# EasyEDA Pro project firefly_rp2040.eprj, schematic Schematic1

## Sheets
1 P1: Board Name: display; Create Date: 2026-06-17; Page Name: P1; Project Name: firefly_rp2040; Schematic Name: Schematic1; Update Date: 2026-09-27; Company: EasyEDA.com; Page Size: A4; Version: V1.0
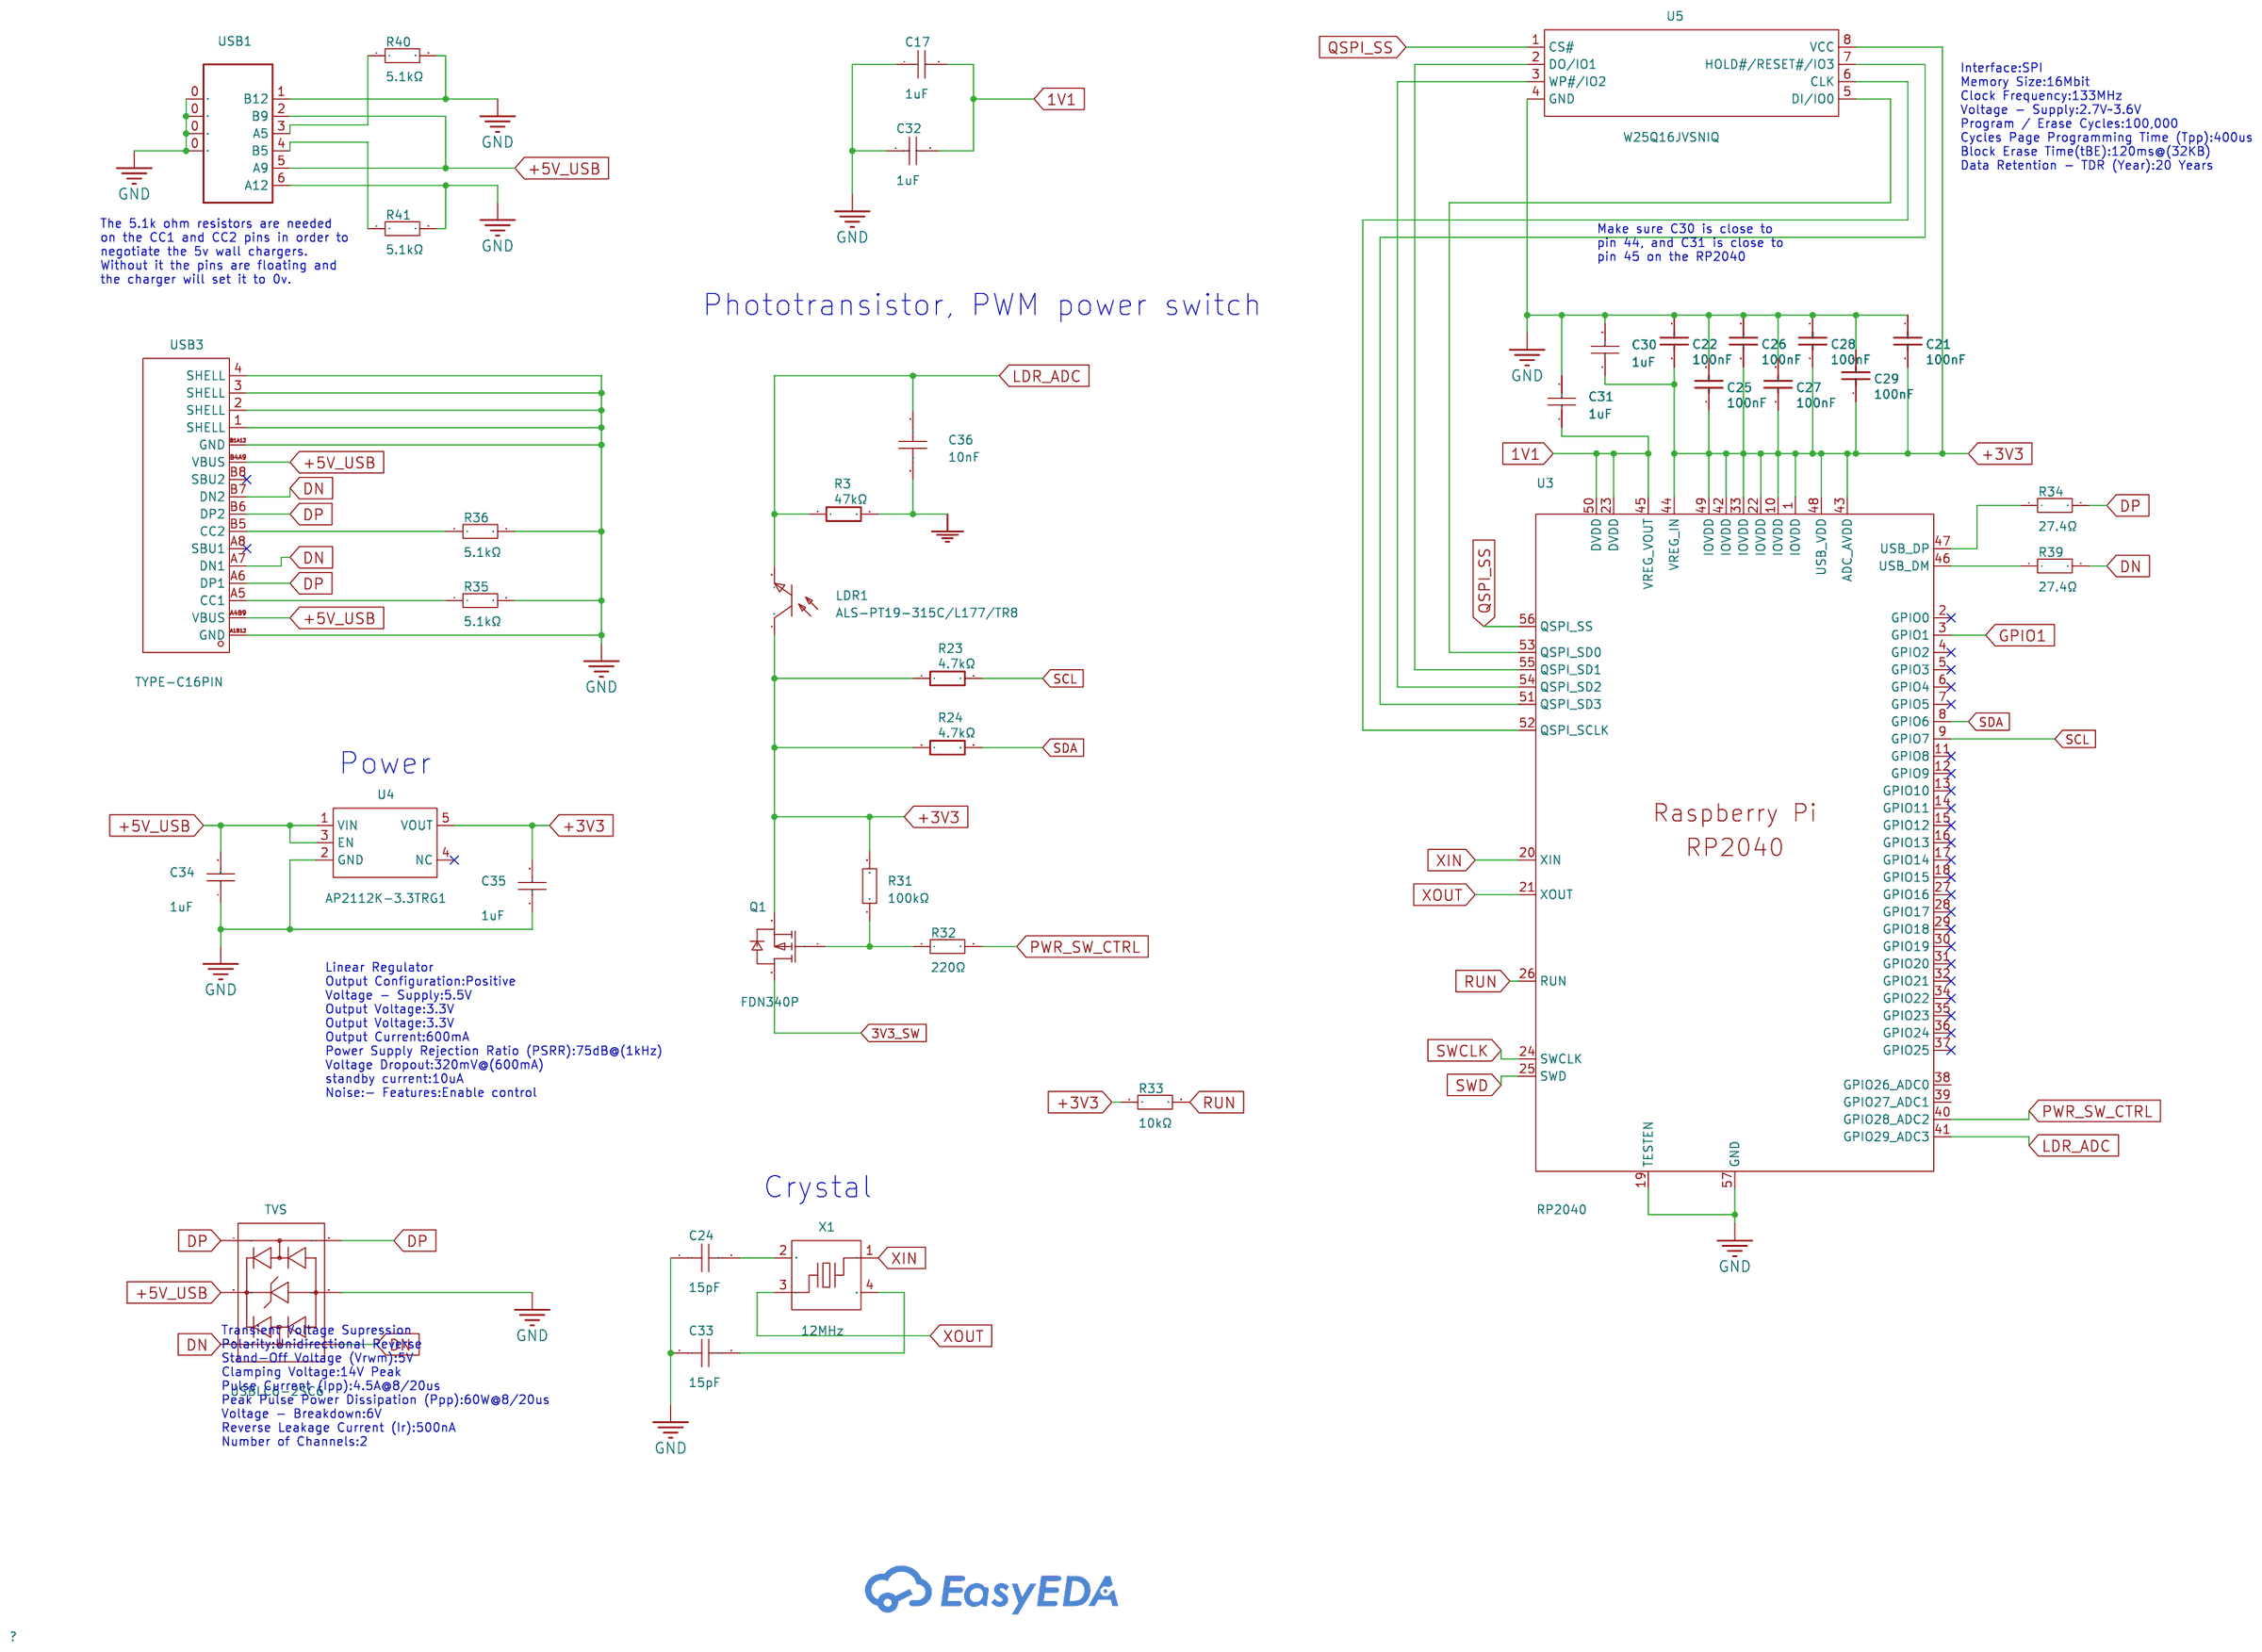
[diagram p0: P1]
2 P2: Board Name: Board1; Page Name: P2; Update Date: 2026-06-16
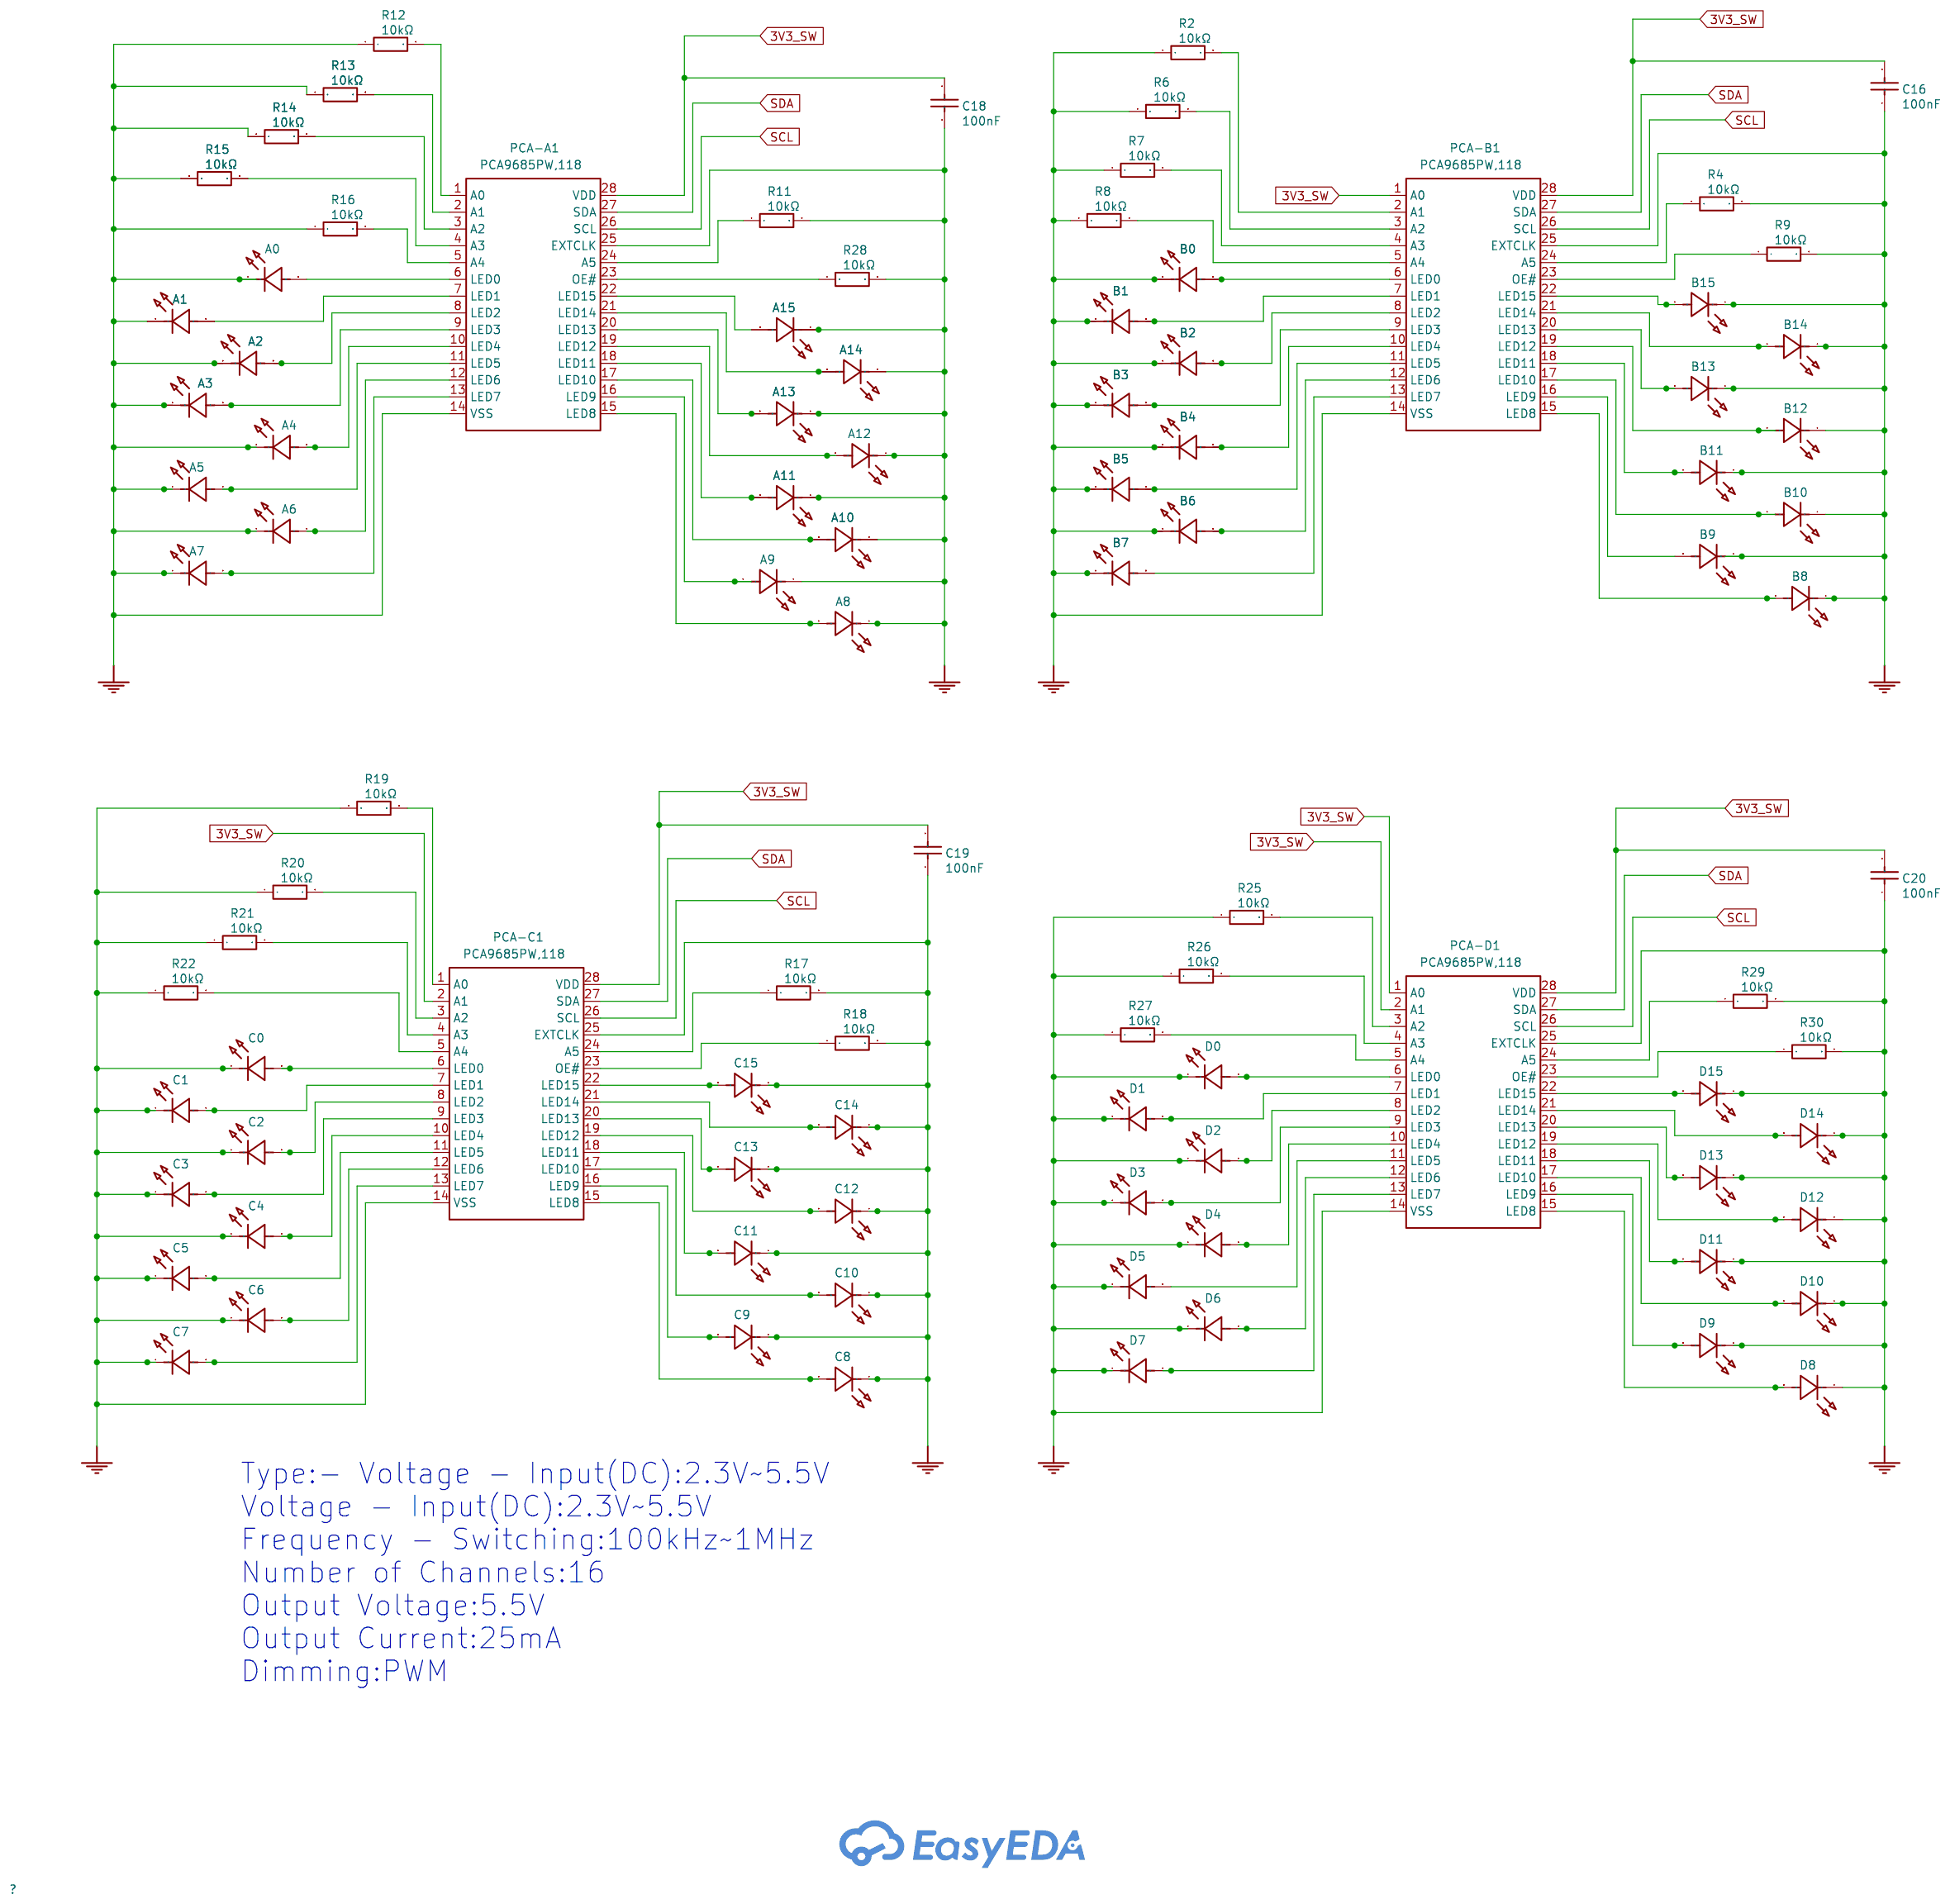
[diagram p1: P2]

## Parts
sheet P1
C17  1uF  [C0603]
C21  100nF  [C0603]
C22  100nF  [C0603]
C24  15pF  [C0603]
C25  100nF  [C0603]
C26  100nF  [C0603]
C27  100nF  [C0603]
C28  100nF  [C0603]
C29  100nF  [C0603]
C30  1uF  [C0603]
C31  1uF  [C0603]
C32  1uF  [C0603]
C33  15pF  [C0603]
C34  1uF  [C0603]
C35  1uF  [C0603]
C36  10nF  [C0603]
LDR1  ALS-PT19-315C/L177/TR8  [SENSORS-SMD_ALS-PT19]
Q1  FDN340P  [SOT-23-3_L3.0-W1.7-P0.95-LS2.9-BR]
R3  47kΩ  [R0603]
R23  4.7kΩ  [R0603]
R24  4.7kΩ  [R0603]
R31  100kΩ  [R0603]
R32  220Ω  [R0603]
R33  10kΩ  [R0603]
R34  27.4Ω  [R0603]
R35  5.1kΩ  [R0603]
R36  5.1kΩ  [R0603]
R39  27.4Ω  [R0603]
R40  5.1kΩ  [R0603]
R41  5.1kΩ  [R0603]
TVS  USBLC6-2SC6  [SOT-23-6_L2.9-W1.6-P0.95-LS2.8-BL]
U3  RP2040  [LQFN-56_L7.0-W7.0-P0.4-EP]
U4  AP2112K-3.3TRG1  [SOT-23-5_L2.9-W1.6-P0.95-LS2.8-BR]
U5  W25Q16JVSNIQ  [SOP-8_L4.9-W3.9-P1.27-LS6.0-BL]
USB1  USB-312-B-SU  [USB-C-SMD_10P-P1.00-L6.8-W8.9]
USB3  TYPE-C16PIN  [USB-C-SMD_TYPE-C16PIN]
X1  12MHz  [CRYSTAL-SMD_4P-L3.2-W2.5-BL]
sheet P2
A0  XL-2012WWC  [LED0805-RD_WHITE]
A1  XL-2012WWC  [LED0805-RD_WHITE]
A2  XL-2012WWC  [LED0805-RD_WHITE]
A3  XL-2012WWC  [LED0805-RD_WHITE]
A4  XL-2012WWC  [LED0805-RD_WHITE]
A5  XL-2012WWC  [LED0805-RD_WHITE]
A6  XL-2012WWC  [LED0805-RD_WHITE]
A7  XL-2012WWC  [LED0805-RD_WHITE]
A8  XL-2012WWC  [LED0805-RD_WHITE]
A9  XL-2012WWC  [LED0805-RD_WHITE]
A10  XL-2012WWC  [LED0805-RD_WHITE]
A11  XL-2012WWC  [LED0805-RD_WHITE]
A12  XL-2012WWC  [LED0805-RD_WHITE]
A13  XL-2012WWC  [LED0805-RD_WHITE]
A14  XL-2012WWC  [LED0805-RD_WHITE]
A15  XL-2012WWC  [LED0805-RD_WHITE]
B0  XL-2012WWC  [LED0805-RD_WHITE]
B1  XL-2012WWC  [LED0805-RD_WHITE]
B2  XL-2012WWC  [LED0805-RD_WHITE]
B3  XL-2012WWC  [LED0805-RD_WHITE]
B4  XL-2012WWC  [LED0805-RD_WHITE]
B5  XL-2012WWC  [LED0805-RD_WHITE]
B6  XL-2012WWC  [LED0805-RD_WHITE]
B7  XL-2012WWC  [LED0805-RD_WHITE]
B8  XL-2012WWC  [LED0805-RD_WHITE]
B9  XL-2012WWC  [LED0805-RD_WHITE]
B10  XL-2012WWC  [LED0805-RD_WHITE]
B11  XL-2012WWC  [LED0805-RD_WHITE]
B12  XL-2012WWC  [LED0805-RD_WHITE]
B13  XL-2012WWC  [LED0805-RD_WHITE]
B14  XL-2012WWC  [LED0805-RD_WHITE]
B15  XL-2012WWC  [LED0805-RD_WHITE]
C0  XL-2012WWC  [LED0805-RD_WHITE]
C1  XL-2012WWC  [LED0805-RD_WHITE]
C2  XL-2012WWC  [LED0805-RD_WHITE]
C3  XL-2012WWC  [LED0805-RD_WHITE]
C4  XL-2012WWC  [LED0805-RD_WHITE]
C5  XL-2012WWC  [LED0805-RD_WHITE]
C6  XL-2012WWC  [LED0805-RD_WHITE]
C7  XL-2012WWC  [LED0805-RD_WHITE]
C8  XL-2012WWC  [LED0805-RD_WHITE]
C9  XL-2012WWC  [LED0805-RD_WHITE]
C10  XL-2012WWC  [LED0805-RD_WHITE]
C11  XL-2012WWC  [LED0805-RD_WHITE]
C12  XL-2012WWC  [LED0805-RD_WHITE]
C13  XL-2012WWC  [LED0805-RD_WHITE]
C14  XL-2012WWC  [LED0805-RD_WHITE]
C15  XL-2012WWC  [LED0805-RD_WHITE]
C16  100nF  [C0603]
C18  100nF  [C0603]
C19  100nF  [C0603]
C20  100nF  [C0603]
D0  XL-2012WWC  [LED0805-RD_WHITE]
D1  XL-2012WWC  [LED0805-RD_WHITE]
D2  XL-2012WWC  [LED0805-RD_WHITE]
D3  XL-2012WWC  [LED0805-RD_WHITE]
D4  XL-2012WWC  [LED0805-RD_WHITE]
D5  XL-2012WWC  [LED0805-RD_WHITE]
D6  XL-2012WWC  [LED0805-RD_WHITE]
D7  XL-2012WWC  [LED0805-RD_WHITE]
D8  XL-2012WWC  [LED0805-RD_WHITE]
D9  XL-2012WWC  [LED0805-RD_WHITE]
D10  XL-2012WWC  [LED0805-RD_WHITE]
D11  XL-2012WWC  [LED0805-RD_WHITE]
D12  XL-2012WWC  [LED0805-RD_WHITE]
D13  XL-2012WWC  [LED0805-RD_WHITE]
D14  XL-2012WWC  [LED0805-RD_WHITE]
D15  XL-2012WWC  [LED0805-RD_WHITE]
PCA-A1  PCA9685PW,118  [TSSOP-28_L9.7-W4.4-P0.65-LS6.4-TL]
PCA-B1  PCA9685PW,118  [TSSOP-28_L9.7-W4.4-P0.65-LS6.4-TL]
PCA-C1  PCA9685PW,118  [TSSOP-28_L9.7-W4.4-P0.65-LS6.4-TL]
PCA-D1  PCA9685PW,118  [TSSOP-28_L9.7-W4.4-P0.65-LS6.4-TL]
R2  10kΩ  [R0603]
R4  10kΩ  [R0603]
R6  10kΩ  [R0603]
R7  10kΩ  [R0603]
R8  10kΩ  [R0603]
R9  10kΩ  [R0603]
R11  10kΩ  [R0603]
R12  10kΩ  [R0603]
R13  10kΩ  [R0603]
R14  10kΩ  [R0603]
R15  10kΩ  [R0603]
R16  10kΩ  [R0603]
R17  10kΩ  [R0603]
R18  10kΩ  [R0603]
R19  10kΩ  [R0603]
R20  10kΩ  [R0603]
R21  10kΩ  [R0603]
R22  10kΩ  [R0603]
R25  10kΩ  [R0603]
R26  10kΩ  [R0603]
R27  10kΩ  [R0603]
R28  10kΩ  [R0603]
R29  10kΩ  [R0603]
R30  10kΩ  [R0603]

## Library data of the parts
C17 C30-C32 C34 C35 = CL10A105KO8NNNC: Capacitance:1uF Tolerance:±10% Tolerance:±10% Voltage Rating:16V Temperature Coefficient:X5R; LCSC Part Name: 1uF ±10% 16V; Supplier Part: C1592; Manufacturer: SAMSUNG(三星); Supplier Footprint: 0603; JLCPCB Part Class: Extended Part; Datasheet: https://item.szlcsc.com/datasheet/CL10A105KO8NNNC/1944.html; Supplier: LCSC; Tolerance: ±10%; Voltage Rating: 16V; Temperature Coefficient: X5R
C16 C18-C22 C25-C29 = TCC0603X7R104J500CT: Capacitance:100nF Tolerance:±5% Tolerance:±5% Voltage Rating:50V Temperature Coefficient:X7R; LCSC Part Name: 100nF ±5% 50V; Supplier Part: C282518; Manufacturer: CCTC(三环); Supplier Footprint: 0603; JLCPCB Part Class: Extended Part; Datasheet: https://item.szlcsc.com/datasheet/TCC0603X7R104J500CT/268638.html; Supplier: LCSC; Tolerance: ±5%; Voltage Rating: 50V; Temperature Coefficient: X7R
C24 C33 = CC0603JRNPO9BN150: Capacitance:15pF Tolerance:±5% Tolerance:±5% Voltage Rating:50V Temperature Coefficient:NP0; LCSC Part Name: 15pF ±5% 50V; Supplier Part: C107037; Manufacturer: YAGEO(国巨); Supplier Footprint: 0603; JLCPCB Part Class: Extended Part; Datasheet: https://item.szlcsc.com/datasheet/CC0603JRNPO9BN150/108253.html; Supplier: LCSC; Tolerance: ±5%; Voltage Rating: 50V; Temperature Coefficient: NP0
C36 = FN18X103K500PSG: Capacitance:10nF Tolerance:±10% Tolerance:±10% Voltage Rating:50V Temperature Coefficient:X7R; LCSC Part Name: 10nF ±10% 50V; Supplier Part: C525264; Manufacturer: PSA(信昌电陶); Supplier Footprint: 0603; JLCPCB Part Class: Extended Part; Datasheet: https://item.szlcsc.com/datasheet/FN18X103K500PSG/543391.html; Supplier: LCSC; Tolerance: ±10%; Voltage Rating: 50V; Temperature Coefficient: X7R
LDR1 = ALS-PT19-315C/L177/TR8: Measurement Type:Light Intensity Voltage - Supply:2.5V~5.5V Voltage - Supply:2.5V~5.5V Operating Temperature:-40℃~+85℃ Operating Temperature:-40℃~+85℃ Length:1.7mm Width:0.8mm Height:0.6mm Features:Spectral correction/filtering; LCSC Part Name: 环境光传感器; Supplier Part: C146233; Manufacturer: EVERLIGHT(亿光); Supplier Footprint: 0603; JLCPCB Part Class: Extended Part; Datasheet: https://en.everlight.com/wp-content/plugins/ItemRelationship/product_files/pdf/ALS-PT19-315C-L177-TR8_V8.pdf; Supplier: LCSC; Measurement Type: Light Intensity; Voltage - Supply: 2.5V~5.5V; Operating Temperature: -40℃~+85℃; Length: 1.7mm; Width: 0.8mm; Height: 0.6mm; Features: Spectral correction/filtering
Q1 = FDN340P_C22365185: LCSC Part Name: P沟道贴片式MOSFET; Supplier Part: C22365185; Manufacturer: FUXINSEMI(富芯森美); Supplier Footprint: SOT-23; JLCPCB Part Class: Extended Part; Datasheet: https://item.szlcsc.com/datasheet/FDN340P/23829803.html; Supplier: LCSC; Drain to Source Voltage: 20V; Current - Continuous Drain(Id): 3A; RDS(on): 142mΩ@2.5V; Pd - Power Dissipation: 400mW; Gate Threshold Voltage (Vgs(th)): 1V@250uA; Gate Charge(Qg): 6.6nC@4.5V; Input Capacitance(Ciss): 500pF; Reverse Transfer Capacitance (Crss@Vds): 80pF; Operating Temperature: -55℃~+150℃; Output Capacitance(Coss): 120pF
R3 = 0603WAJ0473T5E: Type:Thick Film Resistor Resistance:47kΩ Tolerance:±5% Tolerance:±5% Power(Watts):100mW Voltage-Supply(Max):75V Temperature Coefficient:±100ppm/℃ Temperature Coefficient:±100ppm/℃ Operating Temperature:-55℃~+155℃ Operating Temperature:-55℃~+155℃; LCSC Part Name: 厚膜电阻 47kΩ ±5%; Supplier Part: C25600; Manufacturer: UNI-ROYAL(厚声); Supplier Footprint: 0603; JLCPCB Part Class: Extended Part; Datasheet: https://item.szlcsc.com/datasheet/0603WAJ0473T5E/26343.html; Supplier: LCSC; Type: Thick Film Resistor; Tolerance: ±5%; Power(Watts): 100mW; Voltage-Supply(Max): 75V; Temperature Coefficient: ±100ppm/℃; Operating Temperature: -55℃~+155℃
R23 R24 = FRC0603F4701TS: Type:Thick Film Resistor Resistance:4.7kΩ Tolerance:±1% Tolerance:±1% Power(Watts):100mW Voltage-Supply(Max):75V Temperature Coefficient:±100ppm/℃ Temperature Coefficient:±100ppm/℃ Operating Temperature:-55℃~+155℃ Operating Temperature:-55℃~+155℃; LCSC Part Name: 4.7kΩ ±1% 100mW 厚膜电阻; Supplier Part: C2907034; Manufacturer: FOJAN(富捷); Supplier Footprint: 0603; JLCPCB Part Class: Extended Part; Supplier: LCSC; Type: Thick Film Resistor; Tolerance: ±1%; Power(Watts): 100mW; Voltage-Supply(Max): 75V; Temperature Coefficient: ±100ppm/℃; Operating Temperature: -55℃~+155℃
R31 = FRC0603J104 TS: Type:Thick Film Resistor Resistance:100kΩ Tolerance:±5% Tolerance:±5% Power(Watts):100mW Voltage-Supply(Max):75V Temperature Coefficient:±100ppm/℃ Temperature Coefficient:±100ppm/℃ Operating Temperature:-55℃~+155℃ Operating Temperature:-55℃~+155℃; LCSC Part Name: 100kΩ ±5% 100mW 厚膜电阻; Supplier Part: C2907088; Manufacturer: FOJAN(富捷); Supplier Footprint: 0603; JLCPCB Part Class: Extended Part; Supplier: LCSC; Type: Thick Film Resistor; Tolerance: ±5%; Power(Watts): 100mW; Voltage-Supply(Max): 75V; Temperature Coefficient: ±100ppm/℃; Operating Temperature: -55℃~+155℃
R32 = FRC0603J221 TS: Type:Thick Film Resistor Resistance:220Ω Tolerance:±5% Tolerance:±5% Power(Watts):100mW Voltage-Supply(Max):75V Temperature Coefficient:±100ppm/℃ Temperature Coefficient:±100ppm/℃ Operating Temperature:-55℃~+155℃ Operating Temperature:-55℃~+155℃; LCSC Part Name: 220Ω ±5% 100mW 厚膜电阻; Supplier Part: C2907127; Manufacturer: FOJAN(富捷); Supplier Footprint: 0603; JLCPCB Part Class: Extended Part; Supplier: LCSC; Type: Thick Film Resistor; Tolerance: ±5%; Power(Watts): 100mW; Voltage-Supply(Max): 75V; Temperature Coefficient: ±100ppm/℃; Operating Temperature: -55℃~+155℃
R2 R4 R6-R9 R11-R22 R25-R30 R33 = AC0603FR-0710KL: Type:Thick Film Resistors Resistance: Tolerance:±1% Tolerance:±1% Power(Watts): Overload Voltage (Max): Temperature Coefficient:±100ppm/℃ Temperature Coefficient:±100ppm/℃ Operating Temperature Range:-55℃~+155℃ Operating Temperature Range:-55℃~+155℃; LCSC Part Name: 厚膜电阻 10kΩ ±1% 100mW; Supplier Part: C116677; Manufacturer: YAGEO(国巨); Supplier Footprint: 0603; JLCPCB Part Class: Extended Part; Datasheet: https://atta.szlcsc.com/upload/public/pdf/source/20180927/C229861_4ABDC471507C1ED6AFB4BA66AFC8620A.pdf; Supplier: LCSC; Type: Thick Film Resistors; Tolerance: ±1%; Temperature Coefficient: ±100ppm/℃; Operating Temperature Range: -55℃~+155℃
R34 R39 = FRC0603F27R4TS: Type:Thick Film Resistor Resistance:27.4Ω Tolerance:±1% Tolerance:±1% Power(Watts):100mW Voltage-Supply(Max):75V Temperature Coefficient:±100ppm/℃ Temperature Coefficient:±100ppm/℃ Operating Temperature:-55℃~+155℃ Operating Temperature:-55℃~+155℃; LCSC Part Name: 27.4Ω ±1% 100mW 厚膜电阻; Supplier Part: C5126244; Manufacturer: FOJAN(富捷); Supplier Footprint: 0603; JLCPCB Part Class: Extended Part; Datasheet: https://item.szlcsc.com/datasheet/FRC0603F27R4TS/5726591.html; Supplier: LCSC; Type: Thick Film Resistor; Tolerance: ±1%; Power(Watts): 100mW; Voltage-Supply(Max): 75V; Temperature Coefficient: ±100ppm/℃; Operating Temperature: -55℃~+155℃
R35 R36 R40 R41 = FRC0603F5101TS: Type:Thick Film Resistor Resistance:5.1kΩ Tolerance:±1% Tolerance:±1% Power(Watts):100mW Voltage-Supply(Max):75V Temperature Coefficient:±100ppm/℃ Temperature Coefficient:±100ppm/℃ Operating Temperature:-55℃~+155℃ Operating Temperature:-55℃~+155℃; LCSC Part Name: 5.1kΩ ±1% 100mW 厚膜电阻; Supplier Part: C2907044; Manufacturer: FOJAN(富捷); Supplier Footprint: 0603; JLCPCB Part Class: Extended Part; Supplier: LCSC; Type: Thick Film Resistor; Tolerance: ±1%; Power(Watts): 100mW; Voltage-Supply(Max): 75V; Temperature Coefficient: ±100ppm/℃; Operating Temperature: -55℃~+155℃
TVS = USBLC6-2SC6_C21713975: LCSC Part Name: 丝印UL26 单向TVS 5V截止 峰值脉冲电流：4.5A@8/20us; Supplier Part: C21713975; Manufacturer: GOODWORK(固得沃克); Supplier Footprint: SOT-23-6; JLCPCB Part Class: Extended Part; Datasheet: https://item.szlcsc.com/datasheet/USBLC6-2SC6/23140168.html; Supplier: LCSC; Polarity: Unidirectional; Reverse Stand-Off Voltage (Vrwm): 5V; Clamping Voltage: 14V; Peak Pulse Current (Ipp): 4.5A@8/20us; Peak Pulse Power Dissipation (Ppp): 60W@8/20us; Voltage - Breakdown: 6V; Reverse Leakage Current (Ir): 500nA; Number of Channels: 2; Operating Temperature: -55℃~+125℃; level of protection: IEC 61000-4-5；IEC 61000-4-2; Junction Capacitance: 0.6pF
U3 = RP2040_C2040: LCSC Part Name: RP2040（RP2B2）; Supplier Part: C2040; Manufacturer: Raspberry Pi(树莓派); Supplier Footprint: LQFN-56(7x7); JLCPCB Part Class: Extended Part; Datasheet: https://item.szlcsc.com/datasheet/RP2040/2392.html; Supplier: LCSC; CPU Maximum Speed: 133MHz; Number of I/O: 30; ADC (Bit): 12bit
U4 = AP2112K-3.3TRG1_C23380830: LCSC Part Name: 3.3V 600mA 5.5V; Supplier Part: C23380830; Manufacturer: TECH PUBLIC(台舟); Supplier Footprint: SOT-23-5; JLCPCB Part Class: Extended Part; Datasheet: https://item.szlcsc.com/datasheet/AP2112K-3.3TRG1/25111500.html; Supplier: LCSC; Output Configuration: Positive; Voltage - Supply: 5.5V; Output Voltage: 3.3V; Output Current: 600mA; Power Supply Rejection Ratio (PSRR): 75dB@(1kHz); Voltage Dropout: 320mV@(600mA); standby current: 10uA; Features: Enable control；Over Current Protection；Output discharge；Thermal shutdown; Operating Temperature: -40℃~+85℃@(Ta); Output Type: Fixed; Number of Outputs: 1
U5 = W25Q16JVSNIQ_C2456211: LCSC Part Name: 支持双/四路SPI接口的3V、16Mbit 串行闪存; Supplier Part: C2456211; Manufacturer: Winbond(华邦); Supplier Footprint: SOIC-8; JLCPCB Part Class: Extended Part; Datasheet: https://item.szlcsc.com/datasheet/W25Q16JVSNIQ/2548069.html; Supplier: LCSC; Interface: SPI; Memory Size: 16Mbit; Clock Frequency: 133MHz; Voltage - Supply: 2.7V~3.6V; Program / Erase Cycles: 100,000 Cycles; Page Programming Time (Tpp): 400us; Block Erase Time(tBE): 120ms@(32KB); Data Retention - TDR (Year): 20 Years; Operating Temperature: -40℃~+85℃
USB1 = USB-312-B-SU: LCSC Part Name: Type-C 母 卧贴; Supplier Part: C309366; Manufacturer: HOOYA(皓宇电子); Supplier Footprint: SMD; JLCPCB Part Class: Extended Part; Datasheet: https://item.szlcsc.com/datasheet/USB-312-B-SU/293027.html; Supplier: LCSC; Connector Type: Type-C; Gender: Female; Mounting Type: Surface Mount, Right Angle; Number of Contacts: 6P; Number of Ports: 1; Current Rating-Power: 3.5A; Voltage Rating: 5V; Length: 6.9mm; Operating Temperature: -20℃~+60℃
USB3 = TYPE-C16PIN: LCSC Part Name: 16P卧贴母座; Supplier Part: C393939; Manufacturer: SHOU HAN(首韩); Supplier Footprint: SMD; JLCPCB Part Class: Extended Part; Datasheet: https://item.szlcsc.com/datasheet/TYPE-C16PIN/372551.html; Supplier: LCSC; Connector Type: Type-C; Gender: Female; Mounting Type: Surface Mount, Right Angle; Number of Contacts: 16P; Number of Ports: 1; Current Rating-Power: 3A; Voltage Rating: 30V; Connect-Disconnect Life: 10,000 Cycles; Detection color: Black; Operating Temperature: -40℃~+85℃
X1 = 3225 12M 18PF 20PPM: LCSC Part Name: 12MHz ±20ppm 18pF; Supplier Part: C6071564; Manufacturer: SOSET(索斯特); Supplier Footprint: SMD3225-4P; JLCPCB Part Class: Extended Part; Datasheet: https://item.szlcsc.com/datasheet/3225%252012M%252018PF%252020PPM/7011309.html; Supplier: LCSC; Type: Crystal Oscillator; Normal temperature Frequency Tolerance: ±20ppm; Load Capacitance: 18pF; Frequency Stability: ±30ppm; Operating Temperature: -20℃~+85℃
A0-A15 B0-B15 C0-C15 D0-D15 = XL-2012WWC: Supplier: LCSC; Supplier Part: C965820; Manufacturer: XINGLIGHT(成兴光); JLCPCB Part Class: Extended Part; Contributor: lcsc; spicePre: L
PCA-A1 PCA-B1 PCA-C1 PCA-D1 = PCA9685PW,118: LCSC Part Name: 16通道、12位PWM Fm+ I2C总线LED控制器; Supplier Part: C2678753; Manufacturer: NXP(恩智浦); Supplier Footprint: TSSOP-28; JLCPCB Part Class: Extended Part; Datasheet: https://www.nxp.com.cn/docs/en/data-sheet/PCA9685.pdf; Supplier: LCSC; Voltage - Input(DC): 2.3V~5.5V; Frequency - Switching: 100kHz~1MHz; Number of Channels: 16; Output Voltage: 5.5V; Output Current: 25mA; Dimming: PWM; Operating temperature: -40℃~+85℃; Switch Tube (Built-In/External): Built-in

## Nets
1V1: C17.2 C31.1 C32.2 U3.23(DVDD) U3.45(VREG_VOUT) U3.50(DVDD)
3V3_SW: C16.2 C18.2 C19.2 C20.2 PCA-A1.28(VDD) PCA-B1.1(A0) PCA-B1.28(VDD) PCA-C1.2(A1) PCA-C1.28(VDD) PCA-D1.1(A0) PCA-D1.2(A1) PCA-D1.28(VDD) Q1.3(D)
+3V3: C21.1 C22.1 C25.1 C26.1 C27.1 C28.1 C29.1 C30.1 C35.2 LDR1.1(C) Q1.2(S) R23.1 R24.1 R31.2 R33.1 U3.1(IOVDD) U3.10(IOVDD) U3.22(IOVDD) U3.33(IOVDD) U3.42(IOVDD) U3.43(ADC_AVDD) U3.44(VREG_IN) U3.48(USB_VDD) U3.49(IOVDD) U4.5(VOUT) U5.8(VCC)
+5V_USB: C34.2 TVS.5(VBUS) U4.1(VIN) U4.3(EN) USB1.2(B9) USB1.5(A9) USB3.A4B9(VBUS) USB3.B4A9(VBUS)
GND: A0.1(K) A1.1(K) A2.1(K) A3.1(K) A4.1(K) A5.1(K) A6.1(K) A7.1(K) A8.1(K) A9.1(K) A10.1(K) A11.1(K) A12.1(K) A13.1(K) A14.1(K) A15.1(K) B0.1(K) B1.1(K) B2.1(K) B3.1(K) B4.1(K) B5.1(K) B6.1(K) B7.1(K) B8.1(K) B9.1(K) B10.1(K) B11.1(K) B12.1(K) B13.1(K) B14.1(K) B15.1(K) C0.1(K) C1.1(K) C2.1(K) C3.1(K) C4.1(K) C5.1(K) C6.1(K) C7.1(K) C8.1(K) C9.1(K) C10.1(K) C11.1(K) C12.1(K) C13.1(K) C14.1(K) C15.1(K) C16.1 C17.1 C18.1 C19.1 C20.1 C21.2 C22.2 C24.1 C25.2 C26.2 C27.2 C28.2 C29.2 C30.2 C31.2 C32.1 C33.1 C34.1 C35.1 C36.2 D0.1(K) D1.1(K) D2.1(K) D3.1(K) D4.1(K) D5.1(K) D6.1(K) D7.1(K) D8.1(K) D9.1(K) D10.1(K) D11.1(K) D12.1(K) D13.1(K) D14.1(K) D15.1(K) PCA-A1.14(VSS) PCA-A1.25(EXTCLK) PCA-B1.14(VSS) PCA-B1.25(EXTCLK) PCA-C1.14(VSS) PCA-C1.25(EXTCLK) PCA-D1.14(VSS) PCA-D1.25(EXTCLK) R2.1 R3.2 R4.2 R6.1 R7.1 R8.1 R9.2 R11.2 R12.1 R13.1 R14.1 R15.1 R16.1 R17.2 R18.2 R19.1 R20.1 R21.1 R22.1 R25.1 R26.1 R27.1 R28.2 R29.2 R30.2 R35.2 R36.2 R40.2 R41.2 TVS.2(GND) U3.19(TESTEN) U3.57(GND) U4.2(GND) U5.4(GND) USB1.0 USB1.1(B12) USB1.6(A12) USB3.1(SHELL) USB3.2(SHELL) USB3.3(SHELL) USB3.4(SHELL) USB3.A1B12(GND) USB3.B1A12(GND)
DN: R39.2 TVS.1(I/O1) TVS.6(I/O1) USB3.A7(DN1) USB3.B7(DN2)
DP: R34.2 TVS.3(I/O2) TVS.4(I/O2) USB3.A6(DP1) USB3.B6(DP2)
GPIO1: U3.3(GPIO1)
LDR_ADC: C36.1 LDR1.2(E) R3.1 U3.41(GPIO29_ADC3)
PWR_SW_CTRL: R32.2 U3.40(GPIO28_ADC2)
QSPI_SS: U3.56(QSPI_SS) U5.1(CS#)
RUN: R33.2 U3.26(RUN)
SCL: PCA-A1.26(SCL) PCA-B1.26(SCL) PCA-C1.26(SCL) PCA-D1.26(SCL) R23.2 U3.9(GPIO7)
SDA: PCA-A1.27(SDA) PCA-B1.27(SDA) PCA-C1.27(SDA) PCA-D1.27(SDA) R24.2 U3.8(GPIO6)
SWCLK: U3.24(SWCLK)
SWD: U3.25(SWD)
XIN: U3.20(XIN) X1.1
XOUT: U3.21(XOUT) X1.3
$1N878: Q1.1(G) R31.1 R32.1
$1N2988: R34.1 U3.47(USB_DP)
$1N3420: R35.1 USB3.A5(CC1)
$1N3520: R36.1 USB3.B5(CC2)
$1N3802: U3.55(QSPI_SD1) U5.2(DO/IO1)
$1N3811: U3.54(QSPI_SD2) U5.3(WP#/IO2)
$1N3818: U3.51(QSPI_SD3) U5.7(HOLD#/RESET#/IO3)
$1N3834: U3.52(QSPI_SCLK) U5.6(CLK)
$1N3846: U3.53(QSPI_SD0) U5.5(DI/IO0)
$1N4199: R39.1 U3.46(USB_DM)
$1N6880: C24.2 X1.2(GND)
$1N6912: C33.2 X1.4(GND)
$1N17853: R40.1 USB1.3(A5)
$1N17864: R41.1 USB1.4(B5)
$2N3361: A1.2(A) PCA-A1.7(LED1)
$2N3362: A2.2(A) PCA-A1.8(LED2)
$2N3363: A3.2(A) PCA-A1.9(LED3)
$2N3364: A5.2(A) PCA-A1.11(LED5)
$2N3365: A6.2(A) PCA-A1.12(LED6)
$2N3366: A7.2(A) PCA-A1.13(LED7)
$2N3367: A4.2(A) PCA-A1.10(LED4)
$2N3369: A0.2(A) PCA-A1.6(LED0)
$2N3370: B0.2(A) PCA-B1.6(LED0)
$2N3372: B4.2(A) PCA-B1.10(LED4)
$2N3373: B7.2(A) PCA-B1.13(LED7)
$2N3374: B6.2(A) PCA-B1.12(LED6)
$2N3375: B5.2(A) PCA-B1.11(LED5)
$2N3376: B3.2(A) PCA-B1.9(LED3)
$2N3377: B2.2(A) PCA-B1.8(LED2)
$2N3378: B1.2(A) PCA-B1.7(LED1)
$2N3379: C1.2(A) PCA-C1.7(LED1)
$2N3380: C2.2(A) PCA-C1.8(LED2)
$2N3381: C3.2(A) PCA-C1.9(LED3)
$2N3382: C5.2(A) PCA-C1.11(LED5)
$2N3383: C6.2(A) PCA-C1.12(LED6)
$2N3384: C7.2(A) PCA-C1.13(LED7)
$2N3385: C4.2(A) PCA-C1.10(LED4)
$2N3387: C0.2(A) PCA-C1.6(LED0)
$2N3401: PCA-B1.23(OE#) R9.1
$2N3402: PCA-B1.2(A1) R2.2
$2N3403: PCA-B1.3(A2) R6.2
$2N3404: PCA-B1.4(A3) R7.2
$2N3405: PCA-B1.5(A4) R8.2
$2N3406: PCA-B1.24(A5) R4.1
$2N3407: PCA-A1.23(OE#) R28.1
$2N3408: PCA-A1.24(A5) R11.1
$2N3409: PCA-A1.1(A0) R12.2
$2N3410: PCA-A1.2(A1) R13.2
$2N3411: PCA-A1.3(A2) R14.2
$2N3412: PCA-A1.4(A3) R15.2
$2N3413: PCA-A1.5(A4) R16.2
$2N3414: PCA-C1.24(A5) R17.1
$2N3416: PCA-C1.23(OE#) R18.1
$2N3417: PCA-C1.1(A0) R19.2
$2N3418: PCA-C1.3(A2) R20.2
$2N3419: PCA-C1.4(A3) R21.2
$2N3420: PCA-C1.5(A4) R22.2
$2N3422: PCA-D1.5(A4) R27.2
$2N3423: PCA-D1.4(A3) R26.2
$2N3426: PCA-D1.23(OE#) R30.1
$2N3427: PCA-D1.24(A5) R29.1
$2N3432: D0.2(A) PCA-D1.6(LED0)
$2N3433: D4.2(A) PCA-D1.10(LED4)
$2N3434: D7.2(A) PCA-D1.13(LED7)
$2N3435: D6.2(A) PCA-D1.12(LED6)
$2N3436: D5.2(A) PCA-D1.11(LED5)
$2N3437: D3.2(A) PCA-D1.9(LED3)
$2N3438: D2.2(A) PCA-D1.8(LED2)
$2N3439: D1.2(A) PCA-D1.7(LED1)
$2N3440: PCA-D1.3(A2) R25.2
$2N3441: A15.2(A) PCA-A1.22(LED15)
$2N3442: A14.2(A) PCA-A1.21(LED14)
$2N3443: A13.2(A) PCA-A1.20(LED13)
$2N3444: A12.2(A) PCA-A1.19(LED12)
$2N3445: A11.2(A) PCA-A1.18(LED11)
$2N3446: A10.2(A) PCA-A1.17(LED10)
$2N3447: A9.2(A) PCA-A1.16(LED9)
$2N3448: A8.2(A) PCA-A1.15(LED8)
$2N3449: B15.2(A) PCA-B1.22(LED15)
$2N3450: B14.2(A) PCA-B1.21(LED14)
$2N3451: B13.2(A) PCA-B1.20(LED13)
$2N3452: B12.2(A) PCA-B1.19(LED12)
$2N3453: B11.2(A) PCA-B1.18(LED11)
$2N3454: B10.2(A) PCA-B1.17(LED10)
$2N3455: B9.2(A) PCA-B1.16(LED9)
$2N3456: B8.2(A) PCA-B1.15(LED8)
$2N3457: C15.2(A) PCA-C1.22(LED15)
$2N3458: C14.2(A) PCA-C1.21(LED14)
$2N3459: C13.2(A) PCA-C1.20(LED13)
$2N3460: C12.2(A) PCA-C1.19(LED12)
$2N3461: C11.2(A) PCA-C1.18(LED11)
$2N3462: C10.2(A) PCA-C1.17(LED10)
$2N3463: C9.2(A) PCA-C1.16(LED9)
$2N3464: C8.2(A) PCA-C1.15(LED8)
$2N3465: D15.2(A) PCA-D1.22(LED15)
$2N3466: D13.2(A) PCA-D1.20(LED13)
$2N3467: D14.2(A) PCA-D1.21(LED14)
$2N3468: D12.2(A) PCA-D1.19(LED12)
$2N3469: D11.2(A) PCA-D1.18(LED11)
$2N3470: D10.2(A) PCA-D1.17(LED10)
$2N3471: D9.2(A) PCA-D1.16(LED9)
$2N3472: D8.2(A) PCA-D1.15(LED8)

Not connected (* = marked no-connect by the designer): U3 2(GPIO0)* 4(GPIO2)* 5(GPIO3)* 6(GPIO4)* 7(GPIO5)* 11(GPIO8)* 12(GPIO9)* 13(GPIO10)* 14(GPIO11)* 15(GPIO12)* 16(GPIO13)* 17(GPIO14)* 18(GPIO15)* 27(GPIO16)* 28(GPIO17)* 29(GPIO18)* 30(GPIO19)* 31(GPIO20)* 32(GPIO21)* 34(GPIO22)* 35(GPIO23)* 36(GPIO24)* 37(GPIO25)* 38(GPIO26_ADC0) 39(GPIO27_ADC1); U4 4(NC)*; USB3 A8(SBU1)* B8(SBU2)*

## Notes on the sheets
sheet 1
- Interface:SPI
  Memory Size:16Mbit
  Clock Frequency:133MHz
  Voltage - Supply:2.7V~3.6V
  Program / Erase Cycles:100,000
  Cycles Page Programming Time (Tpp):400us
  Block Erase Time(tBE):120ms@(32KB)
  Data Retention - TDR (Year):20 Years
- The 5.1k ohm resistors are needed
  on the CC1 and CC2 pins in order to
  negotiate the 5v wall chargers.
  Without it the pins are floating and
  the charger will set it to 0v.
- Make sure C30 is close to
  pin 44, and C31 is close to
  pin 45 on the RP2040
- Phototransistor, PWM power switch
- Power
- Linear Regulator
  Output Configuration:Positive
  Voltage - Supply:5.5V
  Output Voltage:3.3V
  Output Voltage:3.3V
  Output Current:600mA
  Power Supply Rejection Ratio (PSRR):75dB@(1kHz)
  Voltage Dropout:320mV@(600mA)
  standby current:10uA
  Noise:- Features:Enable control
- Crystal
- Transient Voltage Supression
  Polarity:Unidirectional Reverse
  Stand-Off Voltage (Vrwm):5V
  Clamping Voltage:14V Peak
  Pulse Current (Ipp):4.5A@8/20us
  Peak Pulse Power Dissipation (Ppp):60W@8/20us
  Voltage - Breakdown:6V
  Reverse Leakage Current (Ir):500nA
  Number of Channels:2
sheet 2
- Type:- Voltage - Input(DC):2.3V~5.5V
  Voltage - Input(DC):2.3V~5.5V
  Frequency - Switching:100kHz~1MHz
  Number of Channels:16
  Output Voltage:5.5V
  Output Current:25mA
  Dimming:PWM
